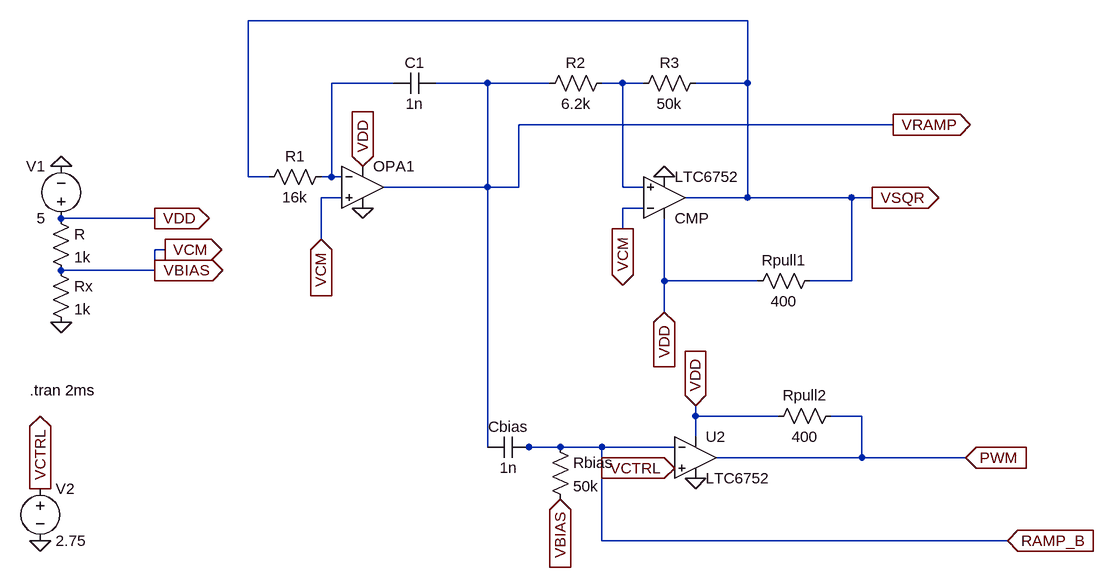
[diagram p0: schematic Analog_Lab1.asc]
Analog_Lab1.asc, the LTspice schematic file:
Version 4.1
SHEET 1 1280 680
WIRE 720 -720 -48 -720
WIRE 176 -624 80 -624
WIRE 320 -624 240 -624
WIRE 416 -624 320 -624
WIRE 528 -624 496 -624
WIRE 560 -624 528 -624
WIRE 720 -624 720 -720
WIRE 720 -624 640 -624
WIRE 944 -560 368 -560
WIRE -48 -480 -48 -720
WIRE -16 -480 -48 -480
WIRE 80 -480 80 -624
WIRE 80 -480 64 -480
WIRE 96 -480 80 -480
WIRE 320 -464 320 -624
WIRE 320 -464 160 -464
WIRE 368 -464 368 -560
WIRE 368 -464 320 -464
WIRE 528 -464 528 -624
WIRE 560 -464 528 -464
WIRE 96 -448 64 -448
WIRE 720 -448 720 -624
WIRE 720 -448 624 -448
WIRE 880 -448 720 -448
WIRE 912 -448 880 -448
WIRE 560 -432 528 -432
WIRE -192 -416 -336 -416
WIRE 528 -400 528 -432
WIRE 64 -384 64 -448
WIRE -176 -368 -192 -368
WIRE -192 -336 -192 -368
WIRE -192 -336 -336 -336
WIRE 592 -320 592 -416
WIRE 736 -320 592 -320
WIRE 880 -320 880 -448
WIRE 880 -320 816 -320
WIRE 592 -272 592 -320
WIRE 640 -112 640 -128
WIRE 768 -112 640 -112
WIRE 896 -112 848 -112
WIRE 640 -80 640 -112
WIRE 320 -64 320 -464
WIRE 384 -64 368 -64
WIRE 432 -64 384 -64
WIRE 496 -64 432 -64
WIRE 608 -64 496 -64
WIRE 896 -48 896 -112
WIRE 896 -48 672 -48
WIRE 1056 -48 896 -48
WIRE 496 80 496 -64
WIRE 1120 80 496 80
FLAG -192 -416 VDD
IOPIN -192 -416 Out
FLAG -176 -368 VCM
IOPIN -176 -368 Out
FLAG -336 -256 0
FLAG -336 -496 0
FLAG 128 -432 0
FLAG 64 -384 VCM
IOPIN 64 -384 In
FLAG 944 -560 VRAMP
IOPIN 944 -560 Out
FLAG 592 -480 0
FLAG 528 -400 VCM
IOPIN 528 -400 Out
FLAG 912 -448 VSQR
IOPIN 912 -448 Out
FLAG 592 -272 VDD
IOPIN 592 -272 In
FLAG 128 -496 VDD
IOPIN 128 -496 In
FLAG -368 80 0
FLAG -368 0 VCTRL
IOPIN -368 0 Out
FLAG 640 -128 VDD
IOPIN 640 -128 In
FLAG 640 -16 0
FLAG 608 -32 VCTRL
IOPIN 608 -32 In
FLAG 1056 -48 PWM
IOPIN 1056 -48 In
FLAG 432 16 VBIAS
IOPIN 432 16 In
FLAG 1120 80 RAMP_B
IOPIN 1120 80 In
FLAG -192 -336 VBIAS
IOPIN -192 -336 Out
SYMBOL voltage -336 -400 R180
WINDOW 0 24 96 Left 2
WINDOW 3 24 16 Left 2
SYMATTR InstName V1
SYMATTR Value 5
SYMBOL res -352 -432 R0
SYMATTR InstName R
SYMATTR Value 1k
SYMBOL res -352 -352 R0
SYMATTR InstName Rx
SYMATTR Value 1k
SYMBOL OpAmps\\UniversalOpAmp2 128 -464 R0
SYMATTR InstName OPA1
SYMBOL res 80 -496 R90
WINDOW 0 0 56 VBottom 2
WINDOW 3 32 56 VTop 2
SYMATTR InstName R1
SYMATTR Value 16k
SYMBOL cap 240 -640 R90
WINDOW 0 0 32 VBottom 2
WINDOW 3 32 32 VTop 2
SYMATTR InstName C1
SYMATTR Value 1n
SYMBOL res 512 -640 R90
WINDOW 0 0 56 VBottom 2
WINDOW 3 32 56 VTop 2
SYMATTR InstName R2
SYMATTR Value 6.2k
SYMBOL res 656 -640 R90
WINDOW 0 0 56 VBottom 2
WINDOW 3 32 56 VTop 2
SYMATTR InstName R3
SYMATTR Value 50k
SYMBOL Comparators\\LTC6752 592 -384 M180
SYMATTR InstName CMP
SYMBOL res 832 -336 R90
WINDOW 0 0 56 VBottom 2
WINDOW 3 32 56 VTop 2
SYMATTR InstName Rpull1
SYMATTR Value 400
SYMBOL voltage -368 -16 R0
SYMATTR InstName V2
SYMATTR Value 2.75
SYMBOL Comparators\\LTC6752 640 -112 R0
SYMATTR InstName U2
SYMBOL cap 384 -80 R90
WINDOW 0 0 32 VBottom 2
WINDOW 3 32 32 VTop 2
SYMATTR InstName Cbias
SYMATTR Value 1n
SYMBOL res 864 -128 R90
WINDOW 0 0 56 VBottom 2
WINDOW 3 32 56 VTop 2
SYMATTR InstName Rpull2
SYMATTR Value 400
SYMBOL res 416 -80 R0
SYMATTR InstName Rbias
SYMATTR Value 50k
TEXT -384 -152 Left 2 !.tran 2ms

The netlist it stands for:
* Analog_Lab1.asc
V1 VDD 0 5
R VDD VBIAS 1k
Rx VBIAS 0 1k
X§OPA1 VBIAS N001 VDD 0 VRAMP level2 Avol=1Meg GBW=10Meg Slew=10Meg Ilimit=25m Rail=0 Vos=0 En=0 Enk=0 In=0 Ink=0 Rin=500Meg  ; pins In+ In- V+ V- OUT
R1 N001 VSQR 16k
C1 VRAMP N001 1n
R2 N002 VRAMP 6.2k
R3 VSQR N002 50k
X§CMP N002 VBIAS VDD 0 VSQR LTC6752  ; pins In+ In- V+ V- OUT
Rpull1 VSQR VDD 400
V2 VCTRL 0 2.75
X§U2 VCTRL RAMP_B VDD 0 PWM LTC6752  ; pins In+ In- V+ V- OUT
Cbias RAMP_B VRAMP 1n
Rpull2 PWM VDD 400
Rbias RAMP_B VBIAS 50k
.tran 2ms
.lib UniversalOpAmp2.lib
.lib LTC7.lib
.backanno
.end